# EAGLE schematic Lab8_ThermistorADC (EAGLE 9.0.1)
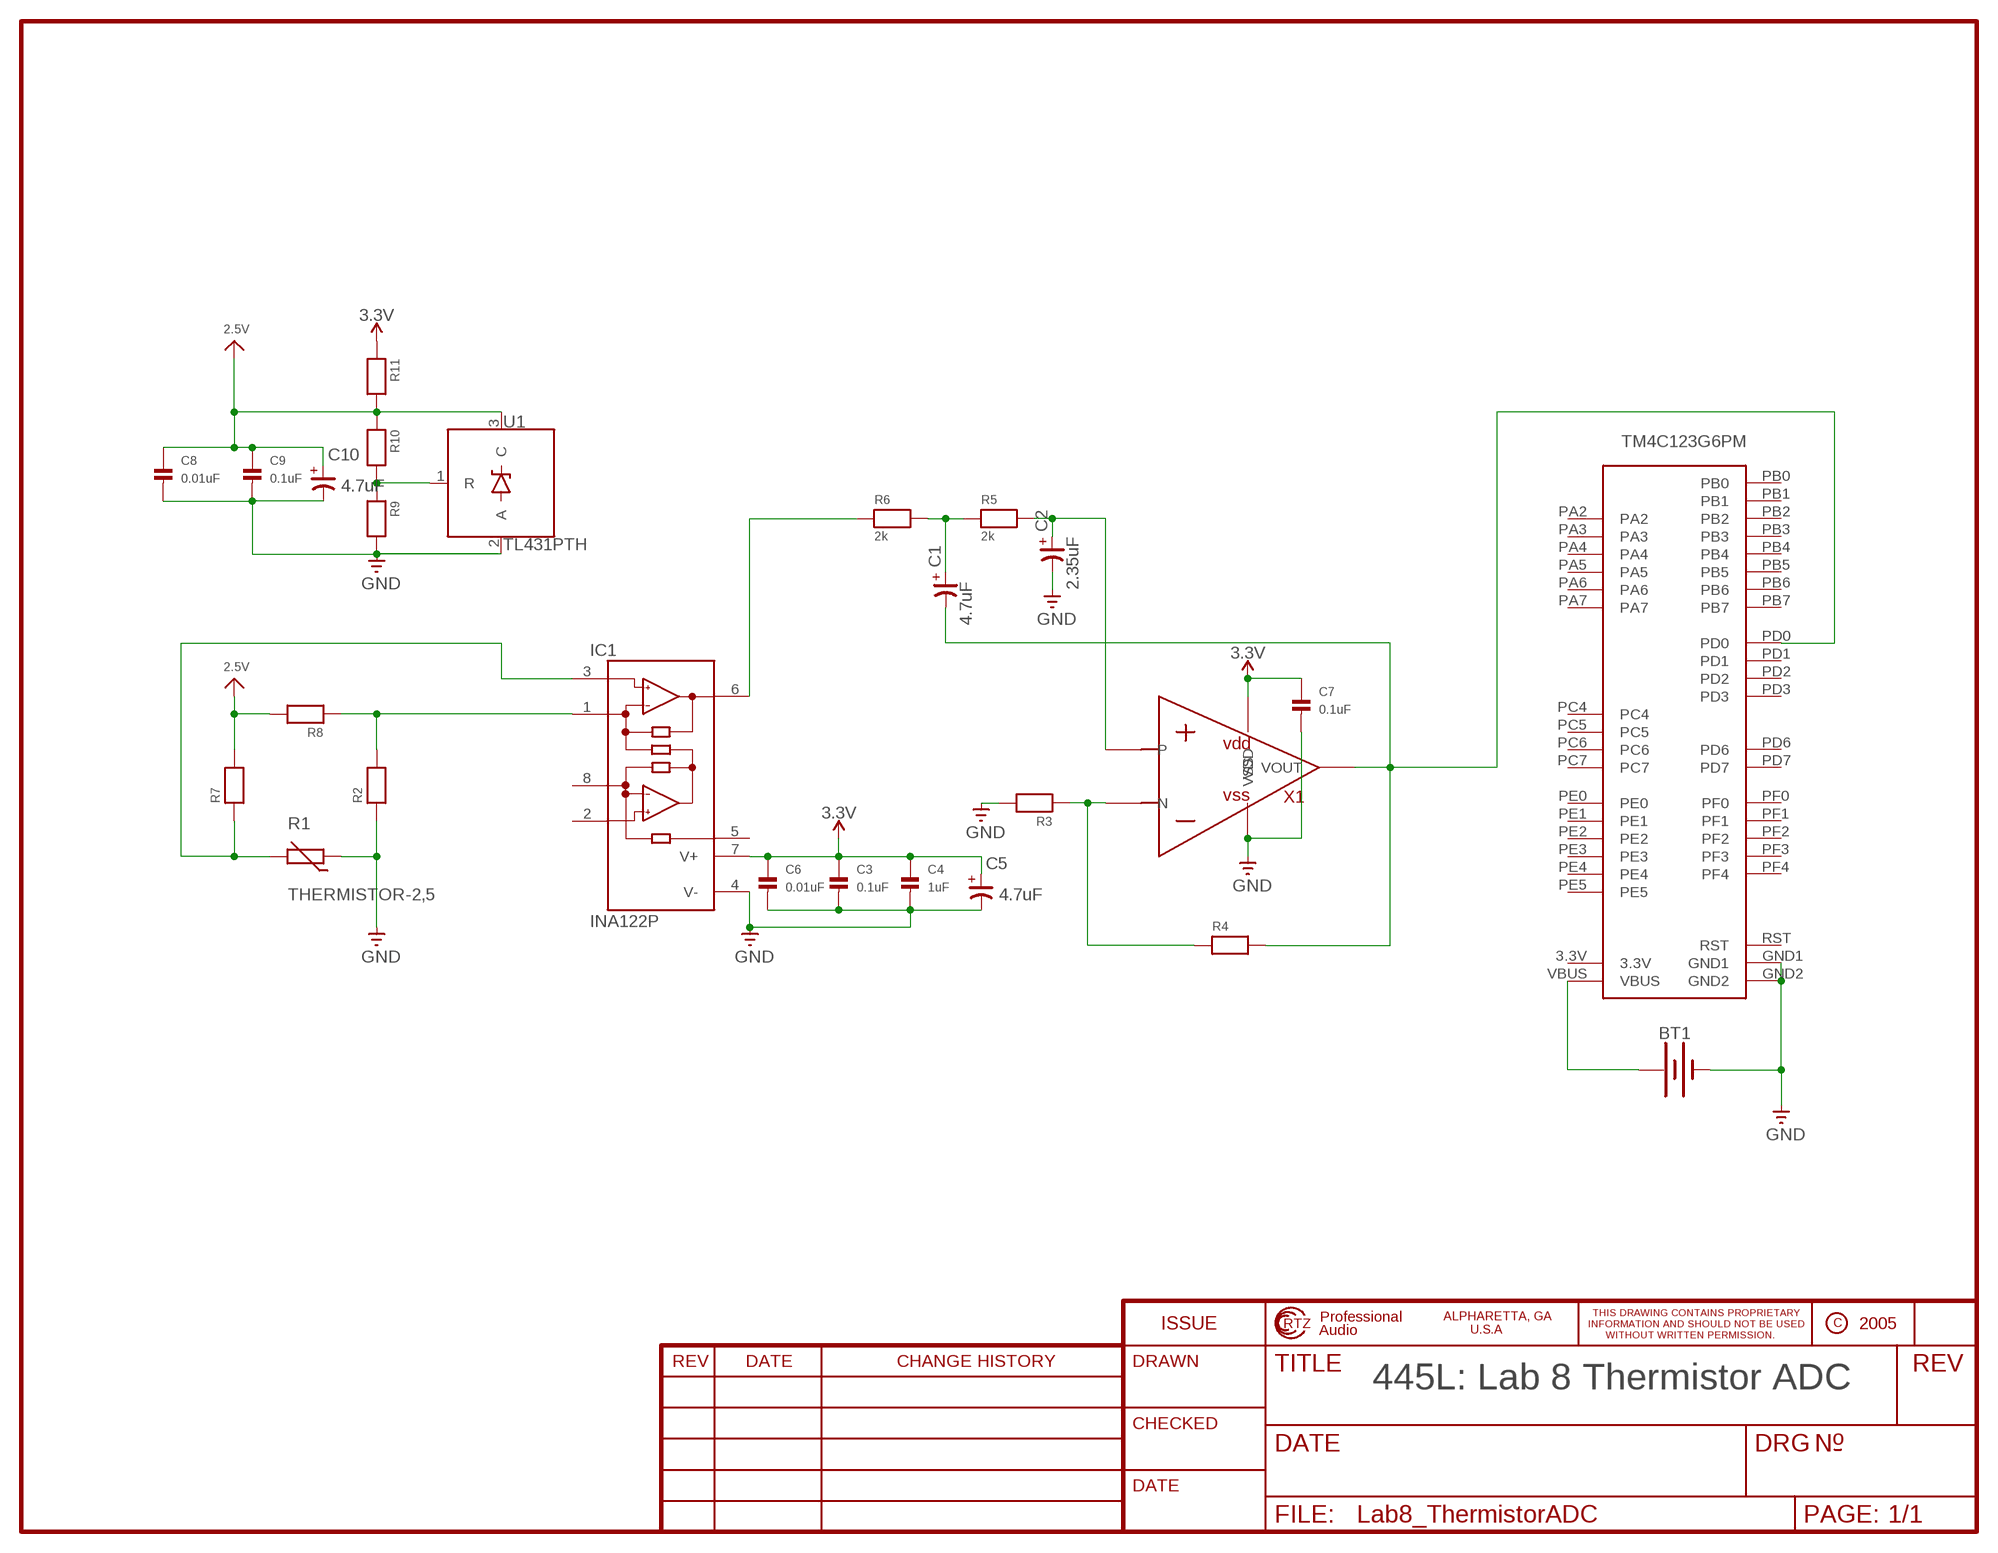
[diagram p0: schematic, sheet 1]

## Parts
BT1  BATTERY-18650  [BATTERY_18650-HOLDER]
C1  4.7uF  CP-140CLH-0810  [140CLH-0810]
C2  2.35uF  CP-140CLH-0810  [140CLH-0810]
C3  0.1uF  CAP_CERAMIC0603  [0603]
C4  1uF  CAP_CERAMIC0603  [0603]
C5  4.7uF  CP-140CLH-0810  [140CLH-0810]
C6  0.01uF  CAP_CERAMIC0603  [0603]
C7  0.1uF  CAP_CERAMIC0603  [0603]
C8  0.01uF  CAP_CERAMIC0603  [0603]
C9  0.1uF  CAP_CERAMIC0603  [0603]
C10  4.7uF  CP-140CLH-0810  [140CLH-0810]
IC1  INA122P  [DIL08]
R1  THERMISTOR-2,5  [RS-2,5]
R2  RESISTOR0805  [0805]
R3  RESISTOR0805  [0805]
R4  RESISTOR0805  [0805]
R5  2k  RESISTOR0805  [0805]
R6  2k  RESISTOR0805  [0805]
R7  RESISTOR0805  [0805]
R8  RESISTOR0805  [0805]
R9  RESISTOR0805  [0805]
R10  RESISTOR0805  [0805]
R11  RESISTOR0805  [0805]
TM4C123G6PM  STELLARIS-LAUNCHPADSTELLARIS-LAUNCHPAD  [LAUNCHPAD-XL]
U1  TL431PTH  [TO-92]
X1  OPAMP  (no package)

## Nets
2.5V: C8.1 C9.1 C10.+ R7.2 R8.2 R10.1 R11.2 U1.3(C)
3.3V: C3.1 C4.1 C5.+ C6.1 C7.1 IC1.7(V+) R11.1 X1.VDD
GND: BT1.GND@1(-) C2.- C3.2 C4.2 C5.- C6.2 C7.2 C8.2 C9.2 C10.- IC1.4(V-) R1.1 R2.1 R3.2 R9.2 TM4C123G6PM.GND1 TM4C123G6PM.GND2 U1.2(A) X1.VSS
N$1: R3.1 R4.1 X1.N
N$2: C1.- R4.2 TM4C123G6PM.PD0 X1.VOUT
N$3: C1.+ R5.1 R6.2
N$4: C2.+ R5.2 X1.P
N$5: BT1.PWR@1(+) TM4C123G6PM.VBUS
N$6: IC1.6(OUT) R6.1
N$7: IC1.1(RG) R2.2 R8.1
N$9: IC1.3(+IN) R1.2 R7.1
N$11: R9.1 R10.2 U1.1(R)
Unconnected: IC1.2(-IN) IC1.5(REF) IC1.8(RG) TM4C123G6PM.PA2 TM4C123G6PM.PA3 TM4C123G6PM.PA4 TM4C123G6PM.PA5 TM4C123G6PM.PA6 TM4C123G6PM.PA7 TM4C123G6PM.PB0 TM4C123G6PM.PB1 TM4C123G6PM.PB2 TM4C123G6PM.PB3 TM4C123G6PM.PB4 TM4C123G6PM.PB5 TM4C123G6PM.PB6 TM4C123G6PM.PB7 TM4C123G6PM.PC4 TM4C123G6PM.PC5 TM4C123G6PM.PC6 TM4C123G6PM.PC7 TM4C123G6PM.PD1 TM4C123G6PM.PD2 TM4C123G6PM.PD3 TM4C123G6PM.PD6 TM4C123G6PM.PD7 TM4C123G6PM.PE0 TM4C123G6PM.PE1 TM4C123G6PM.PE2 TM4C123G6PM.PE3 TM4C123G6PM.PE4 TM4C123G6PM.PE5 TM4C123G6PM.PF0 TM4C123G6PM.PF1 TM4C123G6PM.PF2 TM4C123G6PM.PF3 TM4C123G6PM.PF4

## Notes on the sheet
- 445L: Lab 8 Thermistor ADC

## Power pins joined to a net without a drawn wire
3.3V: TM4C123G6PM.3.3V
RST: TM4C123G6PM.RST

## Library data of the parts
BT1 = SparkFun-Batteries:BATTERY: Battery - Single Cell A variety of battery chemistries, sizes, and footprints. Device List: 20MM_PTH - Coin Cell Battery Holder - 20mm (PTH) <https://www.sparkfun.com/products/783> 6.8MM_PTH - Coin Cell Battery Holder - 6.8MM(SMD) <https://www.digikey.com/product-detail/en/seiko-instruments/MS621FE-FL11E/728-1057-ND/1889208?WT.srch=1&gclid=CNOQ5a6LzdQCFZS2wAodXCkE0g> 12MM_SMD - Coin Cell Battery Holder - 12mm (SMD) <https://www.sparkfun.com/products/10592> 12MM_PTH - Coin Cell Battery Holder - 12mm (PTH) <https://www.sparkfun.com/products/7948> 20MM_SMD - 20mm Coin Cell Battery Holder (SMD) (2 legs) Used on the Big Time Watch Kit <https://www.sparkfun.com/products/11734> 20MM_SMD_4LEGS - Coin Cell Battery Holder - 20mm (SMD) <https://www.sparkfun.com/products/11892> 20MM_SMD_4LEGS_OVERPASTE - Coin Cell Battery Holder - 20mm (SMD) <https://www.sparkfun.com/products/11892> (Over-paste on the legs) 24.5MM_PTH - Coin Cell Battery Holder - 24.5mm (PTH) <https://www.sparkfun.com/products/8863> 9V - 9V Battery Holder - PC Mount Used on the SparkFun SparkPunk Sound Kit <https://www.sparkfun.com/products/11177> and SparkFun SparkPunk Sequencer Kit <https://www.sparkfun.com/products/12707> 18650 - Battery Holder - 18650 (PTH) <https://www.sparkfun.com/products/13113> AA - Battery Holder - 1xAA (PTH) <https://www.sparkfun.com/products/7949> AAA - Battery Holder - 1xAAA (PTH) <https://www.sparkfun.com/products/12718> AA_KIT - Battery Holder - 1xAA (PTH) <https://www.sparkfun.com/products/7949> Special kit package - pads only have exposed copper on one side of the board. AAA_KIT - Battery Holder - 1xAAA (PTH) <https://www.sparkfun.com/products/12718> Special kit package - pads only have exposed copper on one side of the board.; PROD_ID: BATT-12327; SF_SKU: PRT-13113
C1 C2 C5 C10 = cap-master:CP-: POLARIZED CAP
C3 C4 C6-C9 = microbuilder:CAP_CERAMIC: Ceramic Capacitors 0402 - 0402 Surface Mount Capacitors 16pF 50V 5% [Digikey: 445-4899-2-ND] 18pF 50V 5% [Digikey: 490-1281-2-ND] 22pF 50V 5% [Digikey: 490-1283-2-ND] 68pF 50V 5% [Digikey: 490-1289-2-ND] 0.1uF 10V 10% [Digikey: 490-1318-2-ND] 1.0uF 6.3V 10% [Digikey: 490-1320-2-ND] 0603 - 0603 Surface Mount Capacitors 16 pF 50V 5% [Digikey: 445-5051-2-ND] 22 pF 50V [Digikey: PCC220ACVTR-ND] 33 pF 50V 5% [Digikey: 490-1415-1-ND] 56pF 50V 5% [Digikey: 490-1421-1-ND] 220pF 50V 5% [Digikey: 445-1285-1-ND] 680 pF 50V 2200 pF 50V 5% C0G [Digikey: 445-1297-1-ND] 5600 pF 100V 5% X7R [Digikey: 478-3711-1-ND] 0.1 µF 25V 10% [Digikey: PCC2277TR-ND] 0.22 µF 16V 10% X7R [Digikey: 445-1318-1-ND] 1.0 µF 25V 10% [Digikey: 445-5146-2-ND] 0603 - RF Specific 3pF 250V +/-0.1pF RF [Digikey: 712-1347-1-ND] 18 pF 250V 5% [Digikey: 478-3505-1-ND or 712-1322-1-ND] 56 pF 250V 5% C0G RF [Digikey: 490-4867-1-ND] 68 pF 250V RF [Digikey: 490-4868-1-ND] 0805 - 0805 Surface Mount Capacitors 220 pF 250V 2% RF Ceramic Capacitor [Digikey: 712-1398-1-ND] 1000 pF 50V 2% NP0 Ceramic Capacitor [Digikey: 478-3760-1-ND] 0.1 µF 25V 10% Ceramic Capacitor [Digikey: PCC1828TR-ND] 1.0 µF 16V 10% Ceramic Capacitor[Digikey: 490-1691-2-ND] 10.0 µF 10V 10% Ceramic Capacitor[Digikey: 709-1228-1-ND] 10.0 uF 16V 10% Ceramic Capacitor [Digikey: 478-5165-2-ND] 47 uF 6.3V 20% Ceramic Capacitor [Digikey: 587-1779-1-ND or 399-5506-1-ND] 1206 - 1206 Surface Mount Capacitors 47uF 10V 20% Ceramic Capacitor [Digikey: 490-5528-1-ND or 399-5508-1-ND or 445-6010-1-ND]
IC1 = burr-brown:INA122: Instrumentation Amplifier Single Supply, MicroPower; MF: TEXAS INSTRUMENTS; MPN: INA122P; OC_FARNELL: 1459460; OC_NEWARK: 15M0948
R1 = varistor:THERMISTOR: THERMISTOR
R2-R11 = microbuilder:RESISTOR: Resistors 0402 - 0402 Surface Mount Package 22 Ohm 1% 1/16W [Digikey: 311-22.0LRTR-ND] 33 Ohm 5% 1/16W 1.0K 5% 1/16W 1.5K 5% 1/16W 2.0K 1% 1/16W 10.0K 1% 1/16W [Digikey: 311-10.0KLRTR-ND] 10.0K 5% 1/16W [Digikey: RMCF0402JT10K0TR-ND] 12.1K 1% 1/16W [Digikey: 311-22.0LRTR-ND] 100.0K 5% 1/16W 0603 - 0603 Surface Mount Package 0 Ohm 1/10 Watt 1% Resistor 15 Ohm 1/10 Watt 1% Resistor 33 Ohm 1/10 Watt 1% Resistor 49.9 Ohm 1/10 Watt 1% Resistor 100 Ohm 1/10 Watt 1% Resistor 150 Ohm 1/10 Watt 1% Resistor 240 Ohm 1/10 Watt 1% Resistor 390 Ohm 1/10 Watt 1% Resistor 560 Ohm 1/10 Watt 1% Resistor 680 Ohm 1/10 Watt 1% Resistor 750 Ohm 1/10 Watt 1% Resistor 1.0K Ohm 1/10 Watt 1% Resistor 1.5K Ohm 1/10 Watt 1% Resistor 2.0K Ohm 1/10 Watt 1% Resistor 2.2K Ohm 1/10 Watt 1% Resistor 3.3K Ohm 1/10 Watt 1% Resistor 4.7K Ohm 1/10 Watt 1% Resistor 10.0K Ohm 1/10 Watt 1% Resistor 12.0K Ohm 1/10 Watt 1% Resistor 12.1K Ohm 1/10 Watt 1% Resistor 20.0K Ohm 1/10 Watt 1% Resistor 33.0K Ohm 1/10 Watt 1% Resistor 100.0K Ohm 1/10 Watt 1% Resistor 0805 - 0805 Surface Mount Package 0 Ohm 1/8 Watt 1% Resistor 33 Ohm 1/8 Watt 1% Resistor 100 Ohm 1/8 Watt 1% Resistor 150 Ohm 1/8 Watt 1% Resistor 200 Ohm 1/8 Watt 1% Resistor 240 Ohm 1/8 Watt 1% Resistor 330 Ohm 1/8 Watt 1% Resistor 390 Ohm 1/8 Watt 1% Resistor 470 Ohm 1/8 Watt 1% Resistor 1.0K Ohm 1/8 Watt 1% Resistor 1.5K Ohm 1/8 Watt 1% Resistor 2.0K Ohm 1/8 Watt 1% Resistor 4.7K Ohm 1/8 Watt 1% Resistor 5.1K Ohm 1/8 Watt 1% Resistor 5.6K Ohm 1/8 Watt 1% Resistor 10.0K Ohm 1/8 Watt 1% Resistor 22.0K Ohm 1/8 Watt 1% Resistor 33.0K Ohm 1/8 Watt 1% Resistor 100K Ohm 1/8 Watt 1% Resistor 1206 - 1206 Surface Mount Package 2012 - 2010 Surface Mount Package 0.11 Ohm 1/2 Watt 1% Resistor - Digikey: RHM.11UCT-ND
TM4C123G6PM = fabhack:STELLARIS-LAUNCHPAD: Stellaris Launchpad LM4F120 using all header pins to connect to XL booster packs.
U1 = SparkFun-DiscreteSemi:TL431: TL431- Voltage Reference Precision Programmable Shunt Regulator Diode Datasheet <https://cdn.sparkfun.com/datasheets/Components/General%20IC/TL431-D.pdf> SparkFun Products: TL431-Voltage Reference PTH <https://www.sparkfun.com/products/11078> SparkFun Uh-Oh Battery Level Indicator <https://www.sparkfun.com/products/11087>; PROD_ID: IC-10947; SF_ID: COM-11078
X1 = ngspice-simulation:OPAMP: Operational amplifier with power pins